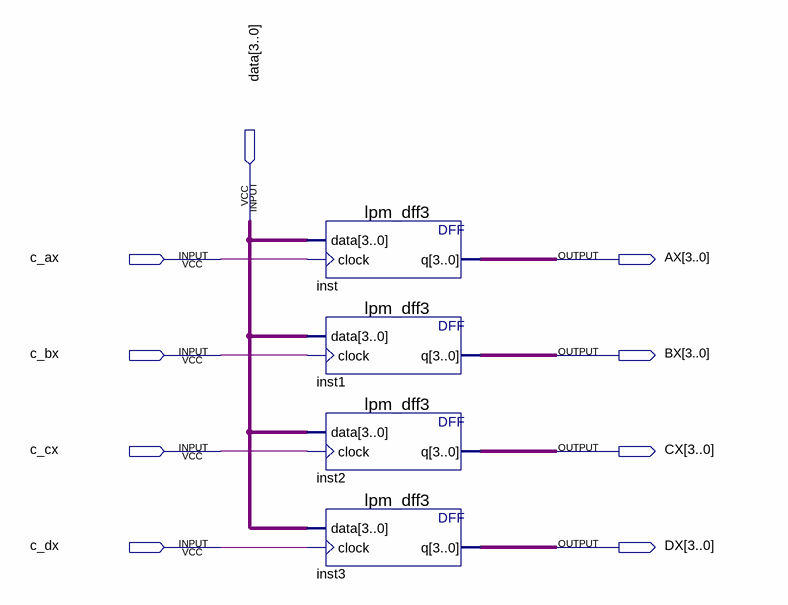
[diagram p0: schematic sheet]
// Quartus schematic RON.bdf as structural Verilog: 4 symbols, 9 pins
module RON (
  input  [3:0] data,
  input  c_ax,
  input  c_bx,
  input  c_cx,
  input  c_dx,
  output [3:0] AX,
  output [3:0] BX,
  output [3:0] CX,
  output [3:0] DX
);

  lpm_dff3 inst (.data(data), .clock(c_ax), .q(AX));
  lpm_dff3 inst1 (.data(data), .clock(c_bx), .q(BX));
  lpm_dff3 inst2 (.data(data), .clock(c_cx), .q(CX));
  lpm_dff3 inst3 (.data(data), .clock(c_dx), .q(DX));
endmodule
